# Altium schematic sheet IScreen2.SchDoc
size A4
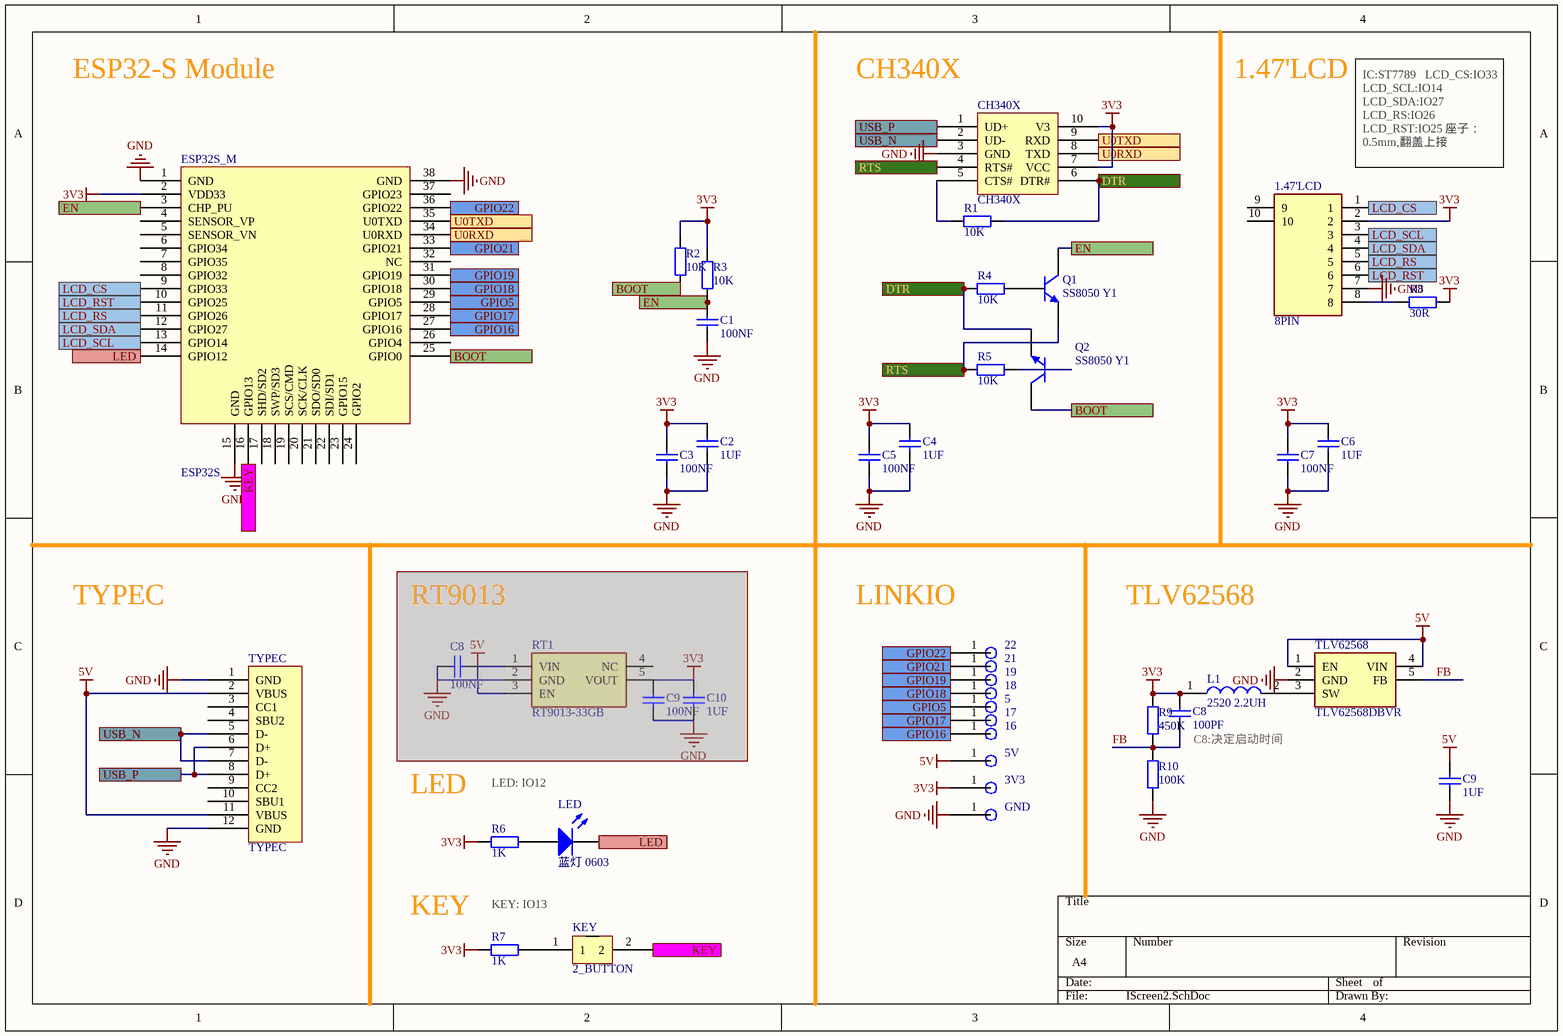
[diagram p0: IScreen2.SchDoc]

## Parts
(Parts that share a designator on the sheet are numbered #1, #2 ... from top to bottom, then left to right.)
1.47'LCD  8PIN  [68710814522]
3V3  TP  [TP_2]  (value not drawn)
5  TP  [TP_2]  (value not drawn)
5V  TP  [TP_2]  (value not drawn)
16  TP  [TP_2]  (value not drawn)
17  TP  [TP_2]  (value not drawn)
18  TP  [TP_2]  (value not drawn)
19  TP  [TP_2]  (value not drawn)
21  TP  [TP_2]  (value not drawn)
22  TP  [TP_2]  (value not drawn)
C1  100NF  [0402_C]
C2  1UF  [0402_C]
C3  100NF  [0402_C]
C4  1UF  [0402_C]
C5  100NF  [0402_C]
C6  1UF  [0402_C]
C7  100NF  [0402_C]
C8#1  100NF  [0402_C]  (masked out: inside a compile mask, not in the netlist)
C8#2  100PF  [0402_C]
C9#1  1UF  [0402_C]
C9#2  100NF  [0402_C]  (masked out: inside a compile mask, not in the netlist)
C10  1UF  [0402_C]  (masked out: inside a compile mask, not in the netlist)
CH340X  CH340X  [TSSOP50P490X110-10N]
ESP32S_M  ESP32S  [ESP32S3]
GND  TP  [TP_2]  (value not drawn)
KEY  2_BUTTON  [342_2_BUTTON]
L1  2520 2.2UH  [INDC2520X100N]
LED  蓝灯 0603  [0603_LED_S1]
Q1  SS8050 Y1  [SOT-23(SOT-23-3)]
Q2  SS8050 Y1  [SOT-23(SOT-23-3)]
R1  10K  [0402_R]
R2  10K  [0402_R]
R3  10K  [0402_R]
R4  10K  [0402_R]
R5  10K  [0402_R]
R6  1K  [0402_R]
R7  1K  [0402_R]
R8  30R  [0402_R]
R9  450K  [0402_R]
R10  100K  [0402_R]
RT1  RT9013-33GB  [SOT94P279X130-5N]  (masked out: inside a compile mask, not in the netlist)
TLV62568  TLV62568DBVR  [SOT95P280X145-5N]
TYPEC  TYPEC  [TYPEC]

## Ports
BOOT (see Bluemousev2), DTR (see Bluemousev2), EN (see Bluemousev2), GPIO5, GPIO16, GPIO17, GPIO18, GPIO19, GPIO21, GPIO22, KEY, LCD_CS, LCD_RS, LCD_RST, LCD_SCL, LCD_SDA, LED, RTS (see Bluemousev2), U0RXD (see Bluemousev2), U0TXD (see Bluemousev2), USB_N (see Bluemousev2), USB_P (see Bluemousev2)

## Nets
3V3: 1.47'LCD.2 3V3.1 C2.2 C3.2 C4.2 C5.2 C6.2 C7.2 C8#2.1 CH340X.7(VCC) CH340X.10(V3) ESP32S_M.2(VDD33) L1.1 R2.1 R3.1 R6.1 R7.1 R8.2 R9.2
5V: 5V.1 C9#1.1 TLV62568.1(EN) TLV62568.4(VIN) TYPEC.2(VBUS) TYPEC.11(VBUS)
GND: 1.47'LCD.7 C1.1 C2.1 C3.1 C4.1 C5.1 C6.1 C7.1 C9#1.2 CH340X.3(GND) ESP32S_M.1(GND) ESP32S_M.15(GND) ESP32S_M.38(GND) GND.1 R10.1 TLV62568.2(GND) TYPEC.1(GND) TYPEC.12(GND)
BOOT: ESP32S_M.25(GPIO0) Q2.3(C) R2.2 ; port BOOT
DTR: CH340X.6(DTR#) Q2.2(E) R1.2 R4.1 ; port DTR
EN: C1.2 ESP32S_M.3(CHP_PU) Q1.3(C) R3.2 ; port EN
FB: C8#2.2 R9.1 R10.2 TLV62568.5(FB)
GPIO5: 5.1 ESP32S_M.29(GPIO5) ; port GPIO5
GPIO16: 16.1 ESP32S_M.27(GPIO16) ; port GPIO16
GPIO17: 17.1 ESP32S_M.28(GPIO17) ; port GPIO17
GPIO18: 18.1 ESP32S_M.30(GPIO18) ; port GPIO18
GPIO19: 19.1 ESP32S_M.31(GPIO19) ; port GPIO19
GPIO21: 21.1 ESP32S_M.33(GPIO21) ; port GPIO21
GPIO22: 22.1 ESP32S_M.36(GPIO22) ; port GPIO22
KEY: ESP32S_M.16(GPIO13) KEY.2 ; port KEY
LCD_CS: 1.47'LCD.1 ESP32S_M.9(GPIO33) ; port LCD_CS
LCD_RS: 1.47'LCD.5 ESP32S_M.11(GPIO26) ; port LCD_RS
LCD_RST: 1.47'LCD.6 ESP32S_M.10(GPIO25) ; port LCD_RST
LCD_SCL: 1.47'LCD.3 ESP32S_M.13(GPIO14) ; port LCD_SCL
LCD_SDA: 1.47'LCD.4 ESP32S_M.12(GPIO27) ; port LCD_SDA
LED: ESP32S_M.14(GPIO12) LED.K ; port LED
RTS: CH340X.4(RTS#) Q1.2(E) R5.1 ; port RTS
U0RXD: CH340X.8(TXD) ESP32S_M.34(U0RXD) ; port U0RXD
U0TXD: CH340X.9(RXD) ESP32S_M.35(U0TXD) ; port U0TXD
USB_N: CH340X.2(UD-) TYPEC.5(D-) TYPEC.7(D-) ; port USB_N
USB_P: CH340X.1(UD+) TYPEC.6(D+) TYPEC.8(D+) ; port USB_P
Net1.47'LCD_8: 1.47'LCD.8 R8.1
NetCH340X_5: CH340X.5(CTS#) R1.1
NetKEY_1: KEY.1 R7.2
NetL1_2: L1.2 TLV62568.3(SW)
NetLED_A: LED.A R6.2
NetQ1_1: Q1.1(B) R4.2
NetQ2_1: Q2.1(B) R5.2

Not connected (* = marked no-connect by the designer): 1.47'LCD 9 10; ESP32S_M 4(SENSOR_VP) 5(SENSOR_VN) 6(GPIO34) 7(GPIO35) 8(GPIO32) 17(SHD/SD2) 18(SWP/SD3) 19(SCS/CMD) 20(SCK/CLK) 21(SDO/SD0) 22(SDI/SD1) 23(GPIO15) 24(GPIO2) 26(GPIO4) 32(NC) 37(GPIO23); TYPEC 3(CC1) 4(SBU2) 9(CC2) 10(SBU1)

## Notes on the sheet
- ESP32-S Module
- (near CH340X) CH340X
- 1.47'LCD
- (near 1.47'LCD) IC:ST7789   LCD_CS:IO33 LCD_SCL:IO14 LCD_SDA:IO27 LCD_RS:IO26  LCD_RST:IO25 座子：0.5mm,翻盖上接
- TYPEC
- RT9013
- LINKIO
- TLV62568
- LED: IO12
- (near C8#2) C8:决定启动时间
- LED
- KEY
- KEY: IO13

## Library data of the parts
1.47'LCD = 68710814522: Connector; Manufacturer_Name: Wurth Elektronik; Datasheet Link: https://www.we-online.com/components/products/datasheet/68710814522.pdf; Height: 2.25mm; Manufacturer_Part_Number: 68710814522; Mouser Part Number: 710-68710814522; Mouser Price/Stock: https://www.mouser.co.uk/ProductDetail/Wurth-Elektronik/68710814522?qs=ZtY9WdtwX54IKWuGjRpduQ%3D%3D
C1-C7 C8#1 C8#2 C9#1 C9#2 C10 = 0603 200pF (201) 10% 50V: 贴片电容; ComponentLink1Description: 供应商链接; ComponentLink1URL: http://www.szlcsc.com/product/details_1952.html; Package: 0603; Supplier: LC; SuppliersPartNumber: C1600
ESP32S_M = ESP32S: module
L1 = MLP2520H2R2MT0S1: Inductor; Manufacturer_Name: TDK; Datasheet Link: https://product.tdk.com/system/files/dam/doc/product/inductor/inductor/smd/catalog/inductor_commercial_power_mlp2520_en.pdf; Height: 1mm; Manufacturer_Part_Number: MLP2520H2R2MT0S1; Mouser Part Number: 810-MLP2520H2R2MT0S1; Mouser Price/Stock: https://www.mouser.co.uk/ProductDetail/TDK/MLP2520H2R2MT0S1?qs=%2FPzWLGNeQ%252Bh4QDAijscZzg%3D%3D; Arrow Part Number: MLP2520H2R2MT0S1; Arrow Price/Stock: https://www.arrow.com/en/products/mlp2520h2r2mt0s1/tdk?region=nac
LED = 0603 蓝灯: 发光二极管; ComponentLink1Description: 供应商链接; ComponentLink1URL: http://www.szlcsc.com/product/details_73150.html; Package: 0603; Supplier: LC; SuppliersPartNumber: C72041
Q1 Q2 = SOT-23 SS8050 Y1: 三极管; ComponentLink1Description: 供应商链接; ComponentLink1URL: http://www.szlcsc.com/product/details_2507.html; Package: SOT-23; Supplier: LC; SuppliersPartNumber: C2150
R1-R10 = 0603 910Ω (9100) 1%: 贴片电阻; ComponentLink1Description: 供应商链接; ComponentLink1URL: http://www.szlcsc.com/product/details_23991.html; Package: 0603; Supplier: LC; SuppliersPartNumber: C23264
RT1 = RT9013-33GB: Power Supply; Manufacturer_Name: RICHTEK; Datasheet Link: https://www.richtek.com/assets/product_file/RT9013/DS9013-10.pdf; Height: 1.295mm; Manufacturer_Part_Number: RT9013-33GB; Mouser Part Number: 835-RT9013-33GB; Mouser Price/Stock: https://www.mouser.co.uk/ProductDetail/Richtek/RT9013-33GB?qs=amGC7iS6iy%2FHaDkSgZH71g%3D%3D
TLV62568 = TLV62568DBVR: Integrated Circuit; Manufacturer_Name: Texas Instruments; Datasheet Link: http://www.ti.com/lit/gpn/tlv62568; Height: 1.45mm; Manufacturer_Part_Number: TLV62568DBVR; Mouser Part Number: 595-TLV62568DBVR; Mouser Price/Stock: https://www.mouser.co.uk/ProductDetail/Texas-Instruments/TLV62568DBVR?qs=0C8XhJW8e4pNapfrvkX1ow%3D%3D; Arrow Part Number: TLV62568DBVR; Arrow Price/Stock: https://www.arrow.com/en/products/tlv62568dbvr/texas-instruments